# EAGLE design modular_battery (EAGLE 9.2.0)
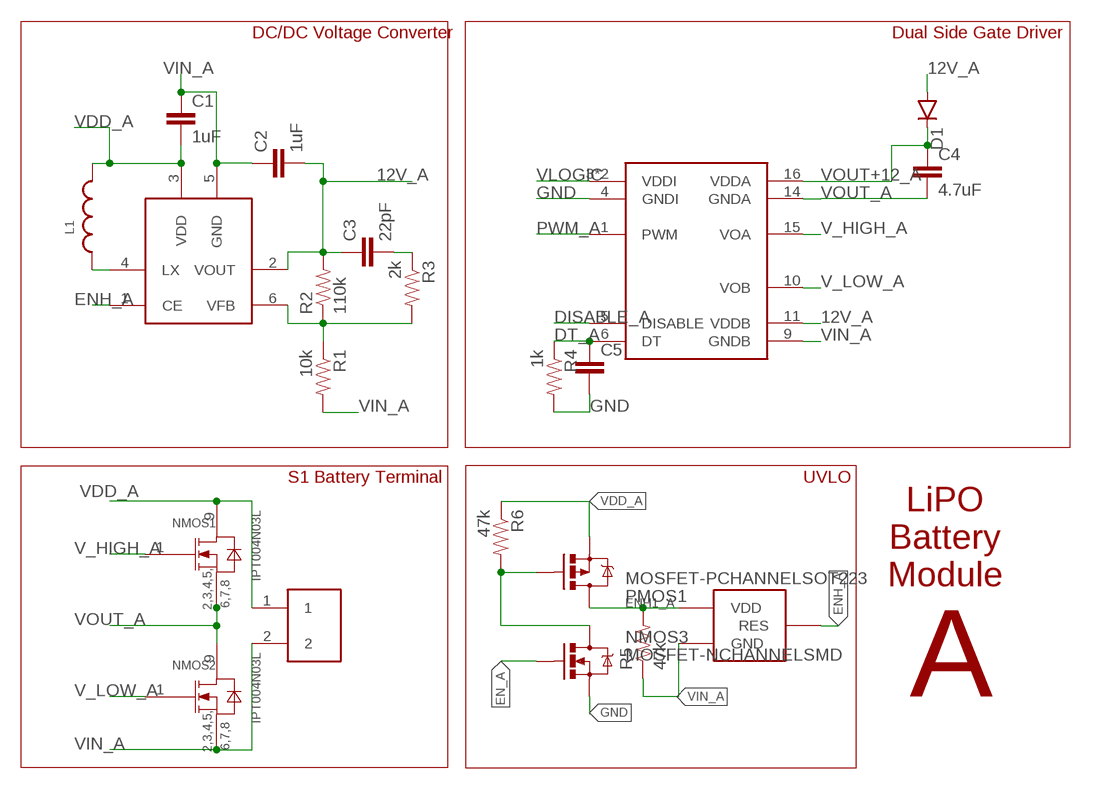
[diagram p0: schematic, sheet 1]

## Parts
C1  1uF  CAP0603-CAP  [0603-CAP]
C2  1uF  CAP0603-CAP  [0603-CAP]
C3  22pF  CAP0603-CAP  [0603-CAP]
C4  4.7uF  CAP0603-CAP  [0603-CAP]
C5  CAP0603-CAP  [0603-CAP]
D1  DIODESMB  [SMB-DIODE]
DRIVER1  SI8231SOIC16W  [SOIC16LWB]
L1  WE-LQS_4025_74404043220A  [WE-LQS_4025]
NMOS1  IPT004N03L  [INF-PG-HSOF-8-1-0]
NMOS2  IPT004N03L  [INF-PG-HSOF-8-1-0]
NMOS3  MOSFET-NCHANNELSMD  [SOT23-3]
PMOS1  MOSFET-PCHANNELSOT223  [SOT223]
R1  10k  RESISTOR0603  [0603-RES]
R2  110k  RESISTOR0603  [0603-RES]
R3  2k  RESISTOR0603  [0603-RES]
R4  1k  RESISTOR0603  [0603-RES]
R5  47k  RESISTOR0603-RES  [0603-RES]
R6  47k  RESISTOR0603-RES  [0603-RES]
U$3  HEADER2  [2PINVALULOK]
VDETECTOR1  BD49XXK__G  [SOT23-3]
VREG1  R1200SOT-23-6  [SOT-23-6]

## Nets
12V_A: C2.2 C3.1 D1.A DRIVER1.11(VDDB) R2.2 VREG1.2(VOUT)
DISABLE_A: DRIVER1.5(DISABLE)
DT_A: C5.1 DRIVER1.6(DT) R4.1
EN_A: NMOS3.1(G)
ENH1_A: PMOS1.2(D) PMOS1.4(D) R5.2 VDETECTOR1.3(VDD)
ENH_A: VDETECTOR1.2(RES) VREG1.1(CE)
GND: C5.2 DRIVER1.4(GNDI) NMOS3.2(S) R4.2
N$1: L1.1 VREG1.4(LX)
N$3: R1.1 R2.1 R3.2 VREG1.6(VFB)
N$5: C3.2 R3.1
N$26: NMOS3.3(D) PMOS1.1(G) R6.2
PWM_A: DRIVER1.1(PWM)
V_HIGH_A: DRIVER1.15(VOA) NMOS1.1
V_LOW_A: DRIVER1.10(VOB) NMOS2.1
VDD_A: C1.2 L1.2 NMOS1.9 PMOS1.3(S) R6.1 U$3.1 VREG1.3(VDD)
VIN_A: C1.1 C2.1 DRIVER1.9(GNDB) NMOS2.2 NMOS2.3 NMOS2.4 NMOS2.5 NMOS2.6 NMOS2.7 NMOS2.8 R1.2 R5.1 U$3.2 VDETECTOR1.1(GND) VREG1.5(GND)
VLOGIC: DRIVER1.3(VDDI) DRIVER1.8(VDDI)
VOUT+12_A: C4.1 D1.C DRIVER1.16(VDDA)
VOUT_A: C4.2 DRIVER1.14(GNDA) NMOS1.2 NMOS1.3 NMOS1.4 NMOS1.5 NMOS1.6 NMOS1.7 NMOS1.8 NMOS2.9

## Notes on the sheet
- DC/DC Voltage Converter | Dual Side Gate Driver
- S1 Battery Terminal | UVLO
- LiPO
  Battery
  Module
- A

## Library data of the parts
C1-C3 = SparkFun-Capacitors:CAP: Capacitor Standard 0603 ceramic capacitor, and 0.1" leaded capacitor.
C4 C5 = SparkFun-Passives:CAP: Capacitor Standard 0603 ceramic capacitor, and 0.1" leaded capacitor.
D1 = SparkFun-DiscreteSemi:DIODE: Diode These are standard reverse protection diodes and small signal diodes. SMA package can handle up to about 1A. SOD-323 can handle about 200mA. What the SOD-323 package when ordering, there are some mfgs out there that are 5-pin packages.; PROD_ID: DIO-09646
DRIVER1 = Custom_old:SI8231
L1 = PowerMagnetics (rev18e):WE-LQS_4025: SMD Shielded Tiny Power Inductor Characteristics Tiny Power Inductor design 1.7 times more current in comparison with unshielded versions Robust design & high durability Low RDC Magnetically shielded with magnetic glue reducing buzz noise in ultra-low levels Operating Temperature: –40 °C to +125 °C Applications Integrated DC/DC Converters Switching controllers which required high efficiency Portable power (Smartphones, digital cameras, Tablets, etc.) Embedded laptops and PCs Big sizes (5040, 60xx, 8040) used for shock-proof circuits <http://katalog.we-online.de/media/images/v2/Family_WE-LQS.jpg> Details see: http://katalog.we-online.de/en/pbs/WE-LQS Created by Dan Xu 2014-05-21 2014 (C) Wurth Elektronik; WE-NUMBER: 74404043220A/22uH
NMOS1 NMOS2 = IPT004N03L:IPT004N03L: IPT004N03L OptiMOS N-Channel Power-Transistor INF-PG-HSOF-8-1-0
NMOS3 = Custom_old:MOSFET-NCHANNEL: Generic NMOS footprint
PMOS1 = Custom_old:MOSFET-PCHANNEL: Generic PMOSFET
R1-R4 = SparkFun-Resistors:RESISTOR: Resistor Basic schematic elements and footprints for 0603, 1206, and PTH resistors.
R5 R6 = SparkFun-Passives:RESISTOR: Resistor Basic schematic elements and footprints for 0603, 1206, and PTH resistors.
U$3 = Custom_old:HEADER2
VDETECTOR1 = Custom_old:BD49XX
VREG1 = Custom_old:R1200

## Module BATTERYMODULE
Ports: 

### Library data of the parts

## Board
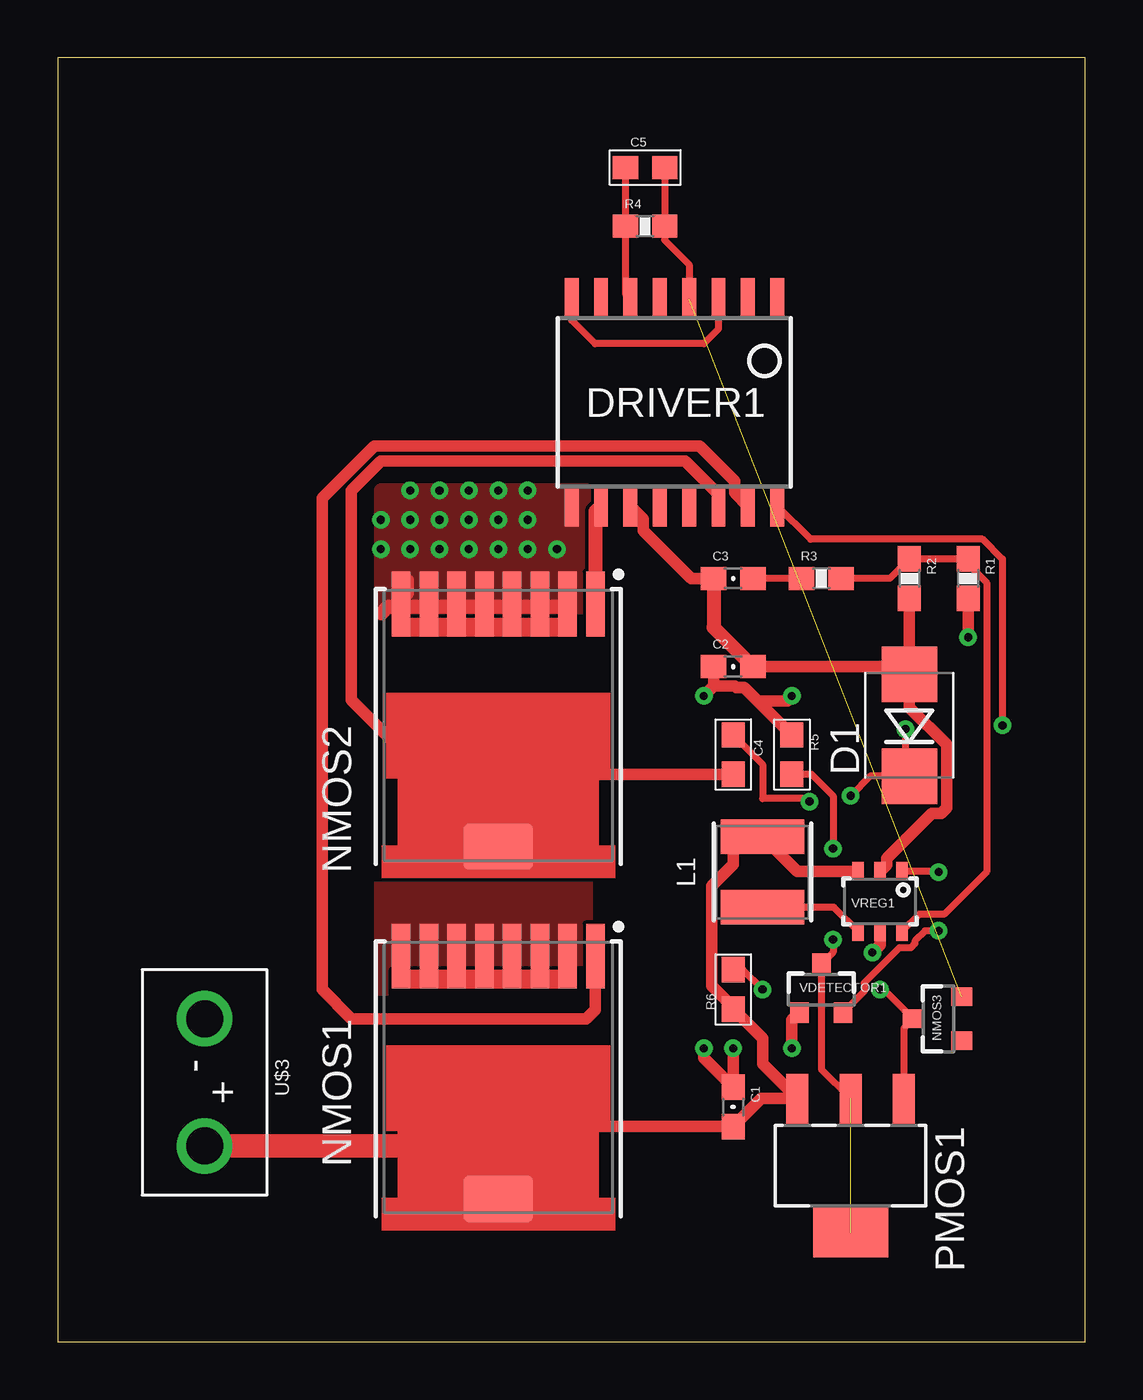
[diagram p1: board, top side]
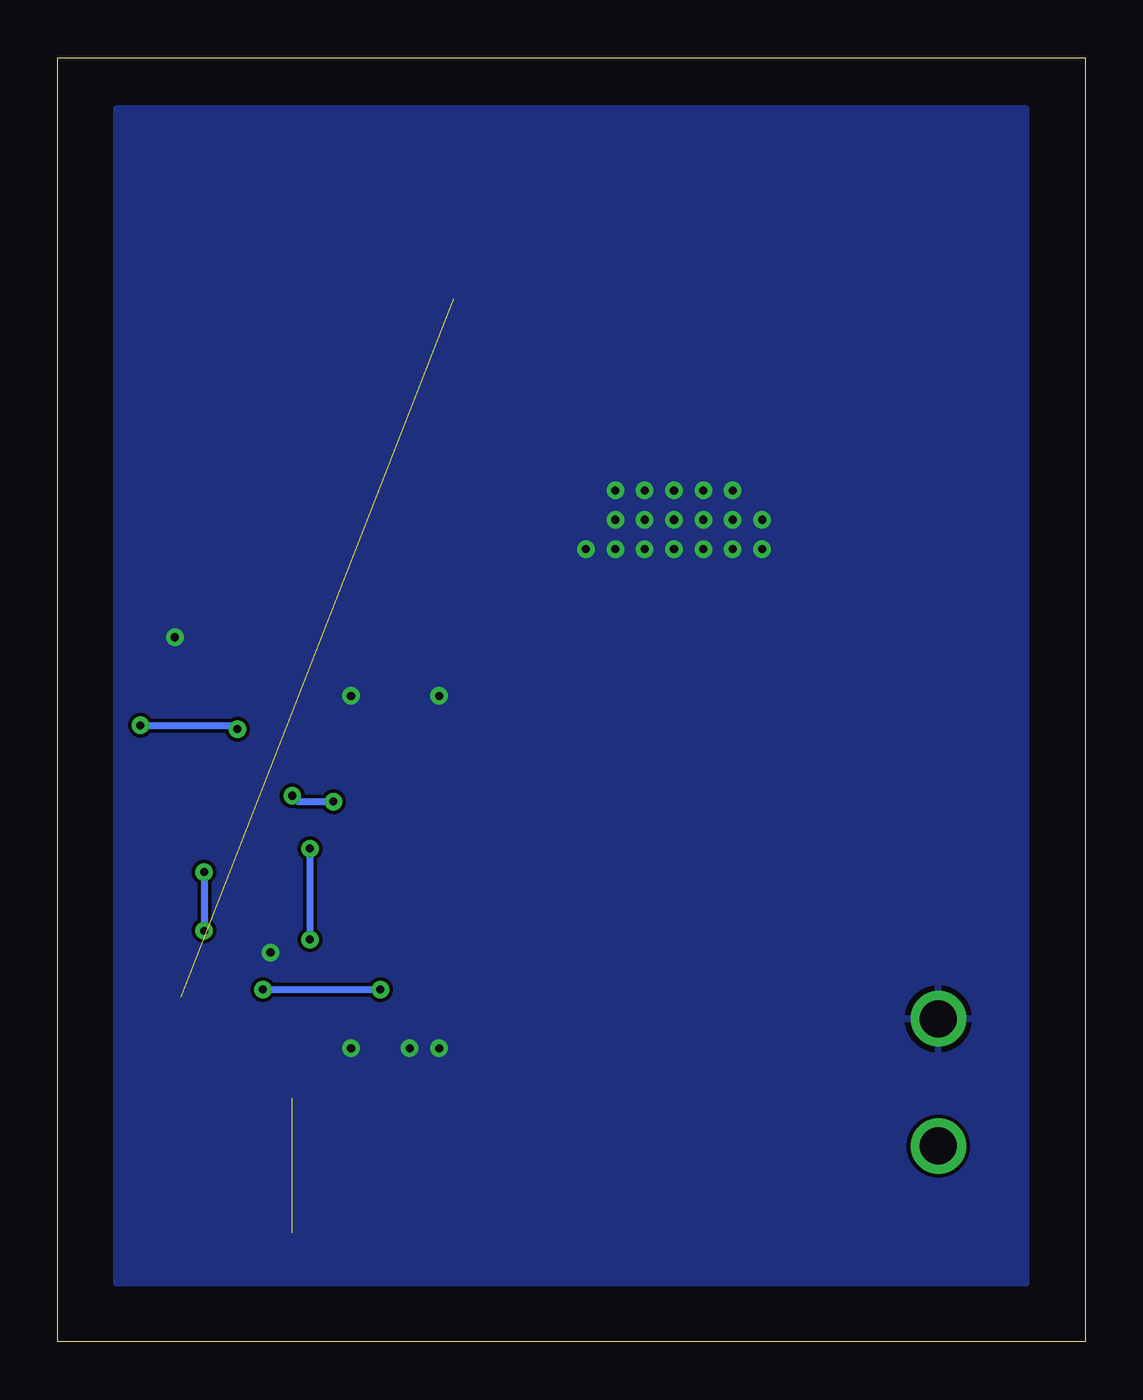
[diagram p2: board, bottom side, seen from below]

Size 44.43 x 55.55 mm. Coordinates in mm from the lower left corner, seen from the top.
Outline: 0,0 44.43,0 44.43,55.55 0,55.55 0,0
Copper layers (1*16): Top 0.035mm / dielectric 1.5mm / Bottom 0.035mm
Design rules "default": minimum track width 6mil, minimum drill 0.35mm, track to track 6mil, track to pad 6mil, pad to pad 6mil, via to via 6mil, smd to smd 6mil, copper to edge 40mil, drill to drill 6mil, minimum pad ring 10mil, minimum via ring 8mil, stop-mask expansion 4mil, vias tented up to drill 0mil, thermal gap 10mil

### Footprints (pad centres in the part's own frame; a part is rotated, then mirrored left to right if it is on the bottom)
0603-CAP = smd 1.1 x 1: 1 -0.85,0; 2 0.85,0
SMB-DIODE = smd 2.4 x 2.4: A 2.2,0; C -2.2,0
SOIC16LWB = smd 0.6 x 1.8: 1 -4.445,-4.475; 2 -3.175,-4.475; 3 -1.905,-4.475; 4 -0.635,-4.475; 5 0.635,-4.475; 6 1.905,-4.475; 7 3.175,-4.475; 8 4.445,-4.475; 9 4.445,4.475; 10 3.175,4.475; 11 1.905,4.475; 12 0.635,4.475; 13 -0.635,4.475; 14 -1.905,4.475; 15 -3.175,4.475; 16 -4.445,4.475
WE-LQS_4025 = smd 1.5 x 3.6: 1 -1.525,0; 2 1.525,0
INF-PG-HSOF-8-1-0 = smd 2.8 x 0.8: 1 -5.25,4.2; 2 -5.25,3; 3 -5.25,1.8; 4 -5.25,0.6; 5 -5.25,-0.6; 6 -5.25,-1.8; 7 -5.25,-3; 8 -5.25,-4.2 | smd 2 x 3: 9 5.25,0
SOT23-3 = smd 0.8 x 0.9: 1 -0.95,-1; 2 0.95,-1; 3 0,1.1
SOT223 = smd 0.95 x 2.15: 1 -2.3,-2.9; 2 0,-2.9; 3 2.3,-2.9 | smd 3.25 x 2.15: 4 0,2.9
0603-RES = smd 1.1 x 1: 1 -0.85,0; 2 0.85,0
2PINVALULOK = drill 1.6: 1 0,5.5; 2 0,0
SOT-23-6 = smd 0.51 x 0.8: 1 -0.95,-1.3; 2 0,-1.3; 3 0.95,-1.3; 4 0.95,1.3; 5 0,1.3; 6 -0.95,1.3

### Placement (x,y rotation side)
C1  29.21,10.16 270 top
C2  29.21,29.21 0 top
C3  29.21,33.02 0 top
C4  29.21,25.4 270 top
C5  25.4,50.8 0 top
D1  36.83,26.67 90 top
DRIVER1  26.67,40.64 180 top
L1  30.48,20.32 90 top
NMOS1  19.05,11.43 270 top
NMOS2  19.05,26.67 270 top
NMOS3  38.1,13.97 90 top
PMOS1  34.29,7.62 180 top
R1  39.37,33.02 270 top
R2  36.83,33.02 270 top
R3  33.02,33.02 0 top
R4  25.4,48.26 0 top
R5  31.75,25.4 270 top
R6  29.21,15.24 90 top
U$3  6.35,13.97 180 top
VDETECTOR1  33.02,15.24 0 top
VREG1  35.56,19.05 180 top

### Tracks (layer width: path | path; a pad name or v marks a point on that pad's centre or on a via)
12V_A
  Top 0.508: R2.2 D1.A | C2.2 36.49,29.21 D1.A | VREG1.2 35.85,20.64 35.85,20.92 37.79,22.86 38.2,22.86 38.44,23.1 38.44,25.84 36.83,27.45 D1.A | DRIVER1.11 25.33,35.6 25.33,35.1 27.41,33.02 C3.1
  Top 0.61: C3.1 28.36,30.91 C2.2
DT_A
  Top 0.305: C5.1 R4.1 24.55,45.33 DRIVER1.6
ENH1_A  (via drill 0.35)  (1 unrouted)
  Top 0.305: PMOS1.2 33.02,11.79 VDETECTOR1.3 33.53,16.85 v33.53,17.4 | v33.53,21.34 33.53,23.62 32.6,24.55 R5.2
  Bottom 0.305: v33.53,21.34 v33.53,17.4
ENH_A  (via drill 0.35)
  Top 0.305: v38.1,17.78 37.51,17.78 37.07,17.34 37.07,17.22 36.89,17.05 36.4,17.05 34.88,15.52 34.88,15.15 VDETECTOR1.2 | v38.1,20.32 38.07,20.35 VREG1.1
  Bottom 0.305: v38.1,20.32 v38.1,17.78
GND  (1 unrouted)
  Top 0.305: C5.2 R4.2 26.25,47.66 27.3,46.61 DRIVER1.4
N$1
  Top 0.305: L1.1 33.56,18.8 VREG1.4
N$3
  Top 0.305: R3.2 35.98,33.02 R2.1 R1.1 39.37,33.65 40.17,32.85 40.17,20.34 38.33,18.49 37.25,18.49 VREG1.6
N$5
  Top 0.305: R3.1 C3.2
N$26  (via drill 0.35)
  Top 0.305: PMOS1.1 36.59,13.56 NMOS3.3 35.73,15.24 v35.56,15.24 | v30.48,15.24 29.63,16.09 R6.2
  Bottom 0.305: v35.56,15.24 v30.48,15.24
V_HIGH_A
  Top 0.508: NMOS1.1 23.25,14.36 22.86,13.97 12.7,13.97 11.43,15.24 11.43,36.49 13.7,38.76 27.75,38.76 29.28,37.23 29.28,36.73 DRIVER1.15
V_LOW_A
  Top 0.61: NMOS2.1 23.25,35.92 DRIVER1.10
VDD_A
  Top 0.508: NMOS1.9 19.13,6.27 22.18,9.31 C1.2 30.42,10.52 PMOS1.3 30.48,12.03 30.48,13.12 R6.1 29.21,14.47 28.27,15.4 28.27,19.71 29.21,20.65 29.21,21.59 29.46,21.84 L1.2 31.98,20.35 VREG1.3
  Top 1.016: U$3.1 16.93,8.47 19.13,6.27
VIN_A  (via drill 0.35)
  Top 0.305: 15.24,33.02 15.24,32.31 NMOS2.8 14.85,32.14
  Top 0.508: C2.1 28.36,28.36 | 28.36,28.36 v27.94,27.94 | 28.36,28.36 29.29,28.36 29.34,28.3 29.7,28.3 30.27,27.73 | R5.1 30.27,27.73 | 30.27,27.73 31.54,27.73 v31.75,27.94 | R1.2 v39.37,30.48 | v29.21,12.7 C1.1 27.94,12.28 v27.94,12.7 | VDETECTOR1.1 31.75,13.92 v31.75,12.7 | VREG1.5 35.56,17.17 v35.23,16.84
  Top 0.61: 13.99,31.51 14.26,31.78 21.91,31.78 NMOS2.2
  other vias: 15.24,35.56 16.51,35.56 17.78,35.56 15.24,34.29 16.51,34.29 17.78,34.29 19.05,34.29 19.05,35.56 20.32,35.56 20.32,34.29 21.59,34.29 15.24,36.83 16.51,36.83 17.78,36.83 19.05,36.83 20.32,36.83 13.97,35.56 13.97,34.29
  pour Top (no thermals): 13.97,31.75 22.86,31.75 22.86,36.83 13.97,36.83
  pour Bottom: 41.91,2.54 2.54,2.54 2.54,53.34 41.91,53.34
VLOGIC
  Top 0.305: DRIVER1.8 22.22,44.2 23.24,43.18 27.94,43.18 28.57,43.82 DRIVER1.3
VOUT+12_A  (via drill 0.35)
  Top 0.305: C4.1 30.48,24.98 30.48,23.49 32.38,23.49 v32.51,23.37 | v34.29,23.62 35.14,24.47 D1.C | 36.83,25.1 D1.C | DRIVER1.16 32.55,34.73 40,34.73 40.86,33.86 v40.86,26.67 | D1.C 36.66,24.64 v36.66,26.5
  Bottom 0.305: v32.51,23.37 34.04,23.37 v34.29,23.62 | v36.66,26.5 36.83,26.67 v40.86,26.67
VOUT_A
  Top 0.508: C4.2 22.18,24.55 NMOS2.9 12.7,27.77 12.7,36.83 13.97,38.1 27.14,38.1 28.57,36.67 DRIVER1.14
  Top 0.61: 17.61,21.42 NMOS2.9 19.22,21.42
  pour Top (no thermals): 13.97,15.24 22.86,15.24 22.86,27.94 13.97,27.94